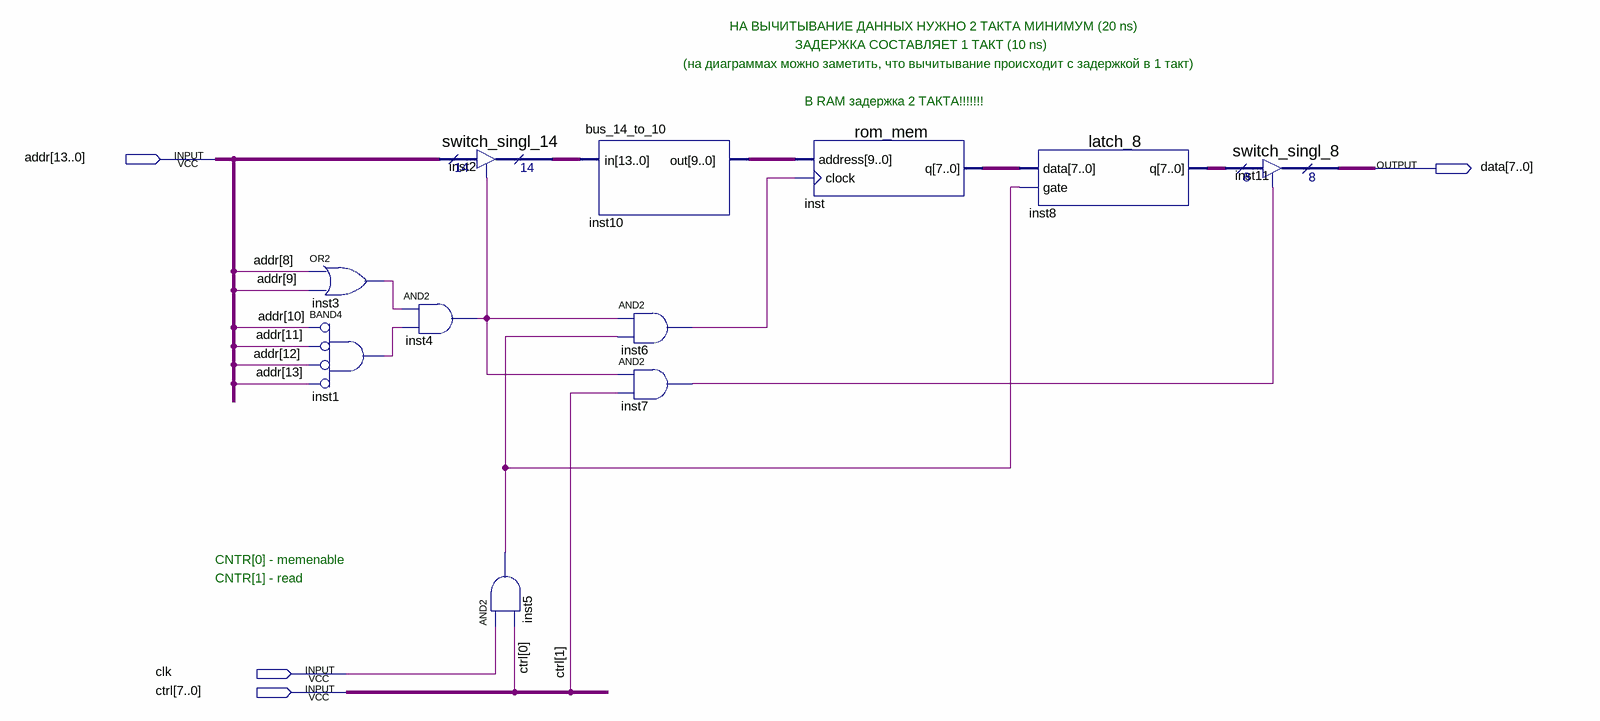
[diagram p0: schematic sheet]
// Quartus schematic rom.bdf as structural Verilog: 11 symbols, 4 pins
module rom (
  input  [13:0] addr,
  input  clk,
  input  [7:0] ctrl,
  output [7:0] data
);

  wire inst1_out, inst3_out, inst4_out, inst5_out, inst6_out, inst7_out;
  wire [7:0] inst8_q, inst_q;
  wire [9:0] inst10_out;
  wire [13:0] inst2_tridata;

  or inst3 (inst3_out, addr[8], addr[9]);
  and inst1 (inst1_out, ~addr[10], ~addr[11], ~addr[12], ~addr[13]);  // BAND4
  and inst4 (inst4_out, inst3_out, inst1_out);
  switch_singl_14 inst2 (.enabledt(inst4_out), .data(addr), .tridata(inst2_tridata));
  and inst5 (inst5_out, clk, ctrl[0]);
  bus_14_to_10 inst10 (.in(inst2_tridata), .out(inst10_out));
  and inst6 (inst6_out, inst4_out, inst5_out);
  and inst7 (inst7_out, inst4_out, ctrl[1]);
  rom_mem inst (.address(inst10_out), .clock(inst6_out), .q(inst_q));
  latch_8 inst8 (.data(inst_q), .gate(inst5_out), .q(inst8_q));
  switch_singl_8 inst11 (.enabledt(inst7_out), .data(inst8_q), .tridata(data));

  // Notes on the sheet:
  //   НА ВЫЧИТЫВАНИЕ ДАННЫХ НУЖНО 2 ТАКТА МИНИМУМ (20 ns)
  //   ЗАДЕРЖКА СОСТАВЛЯЕТ 1 ТАКТ (10 ns)
  //   (на диаграммах можно заметить, что вычитывание происходит с задержкой в 1 такт)
  //   В RAM задержка 2 ТАКТА!!!!!!!
  //   CNTR[0] - memenable
  //   CNTR[1] - read
endmodule
